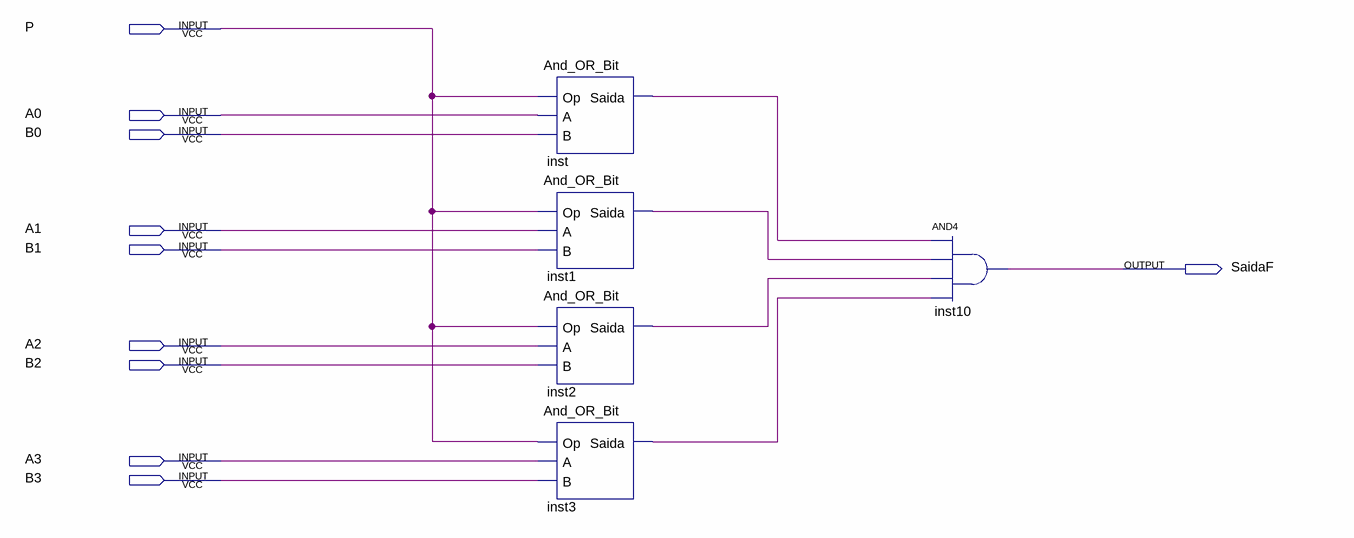
[diagram p0: schematic sheet]
// Quartus schematic And_Or_4bit.bdf as structural Verilog: 5 symbols, 10 pins
module And_Or_4bit (
  input  P,
  input  A0,
  input  B0,
  input  A1,
  input  B1,
  input  A2,
  input  B2,
  input  A3,
  input  B3,
  output SaidaF
);

  wire inst1_saida, inst2_saida, inst3_saida, inst_saida;

  And_OR_Bit inst (.Op(P), .A(A0), .B(B0), .Saida(inst_saida));
  And_OR_Bit inst1 (.Op(P), .A(A1), .B(B1), .Saida(inst1_saida));
  And_OR_Bit inst2 (.Op(P), .A(A2), .B(B2), .Saida(inst2_saida));
  And_OR_Bit inst3 (.Op(P), .A(A3), .B(B3), .Saida(inst3_saida));
  and inst10 (SaidaF, inst_saida, inst1_saida, inst2_saida, inst3_saida);
endmodule
